# Altium schematic sheet Si5395_CLK_GEN.SchDoc
size 594 x 420 mm
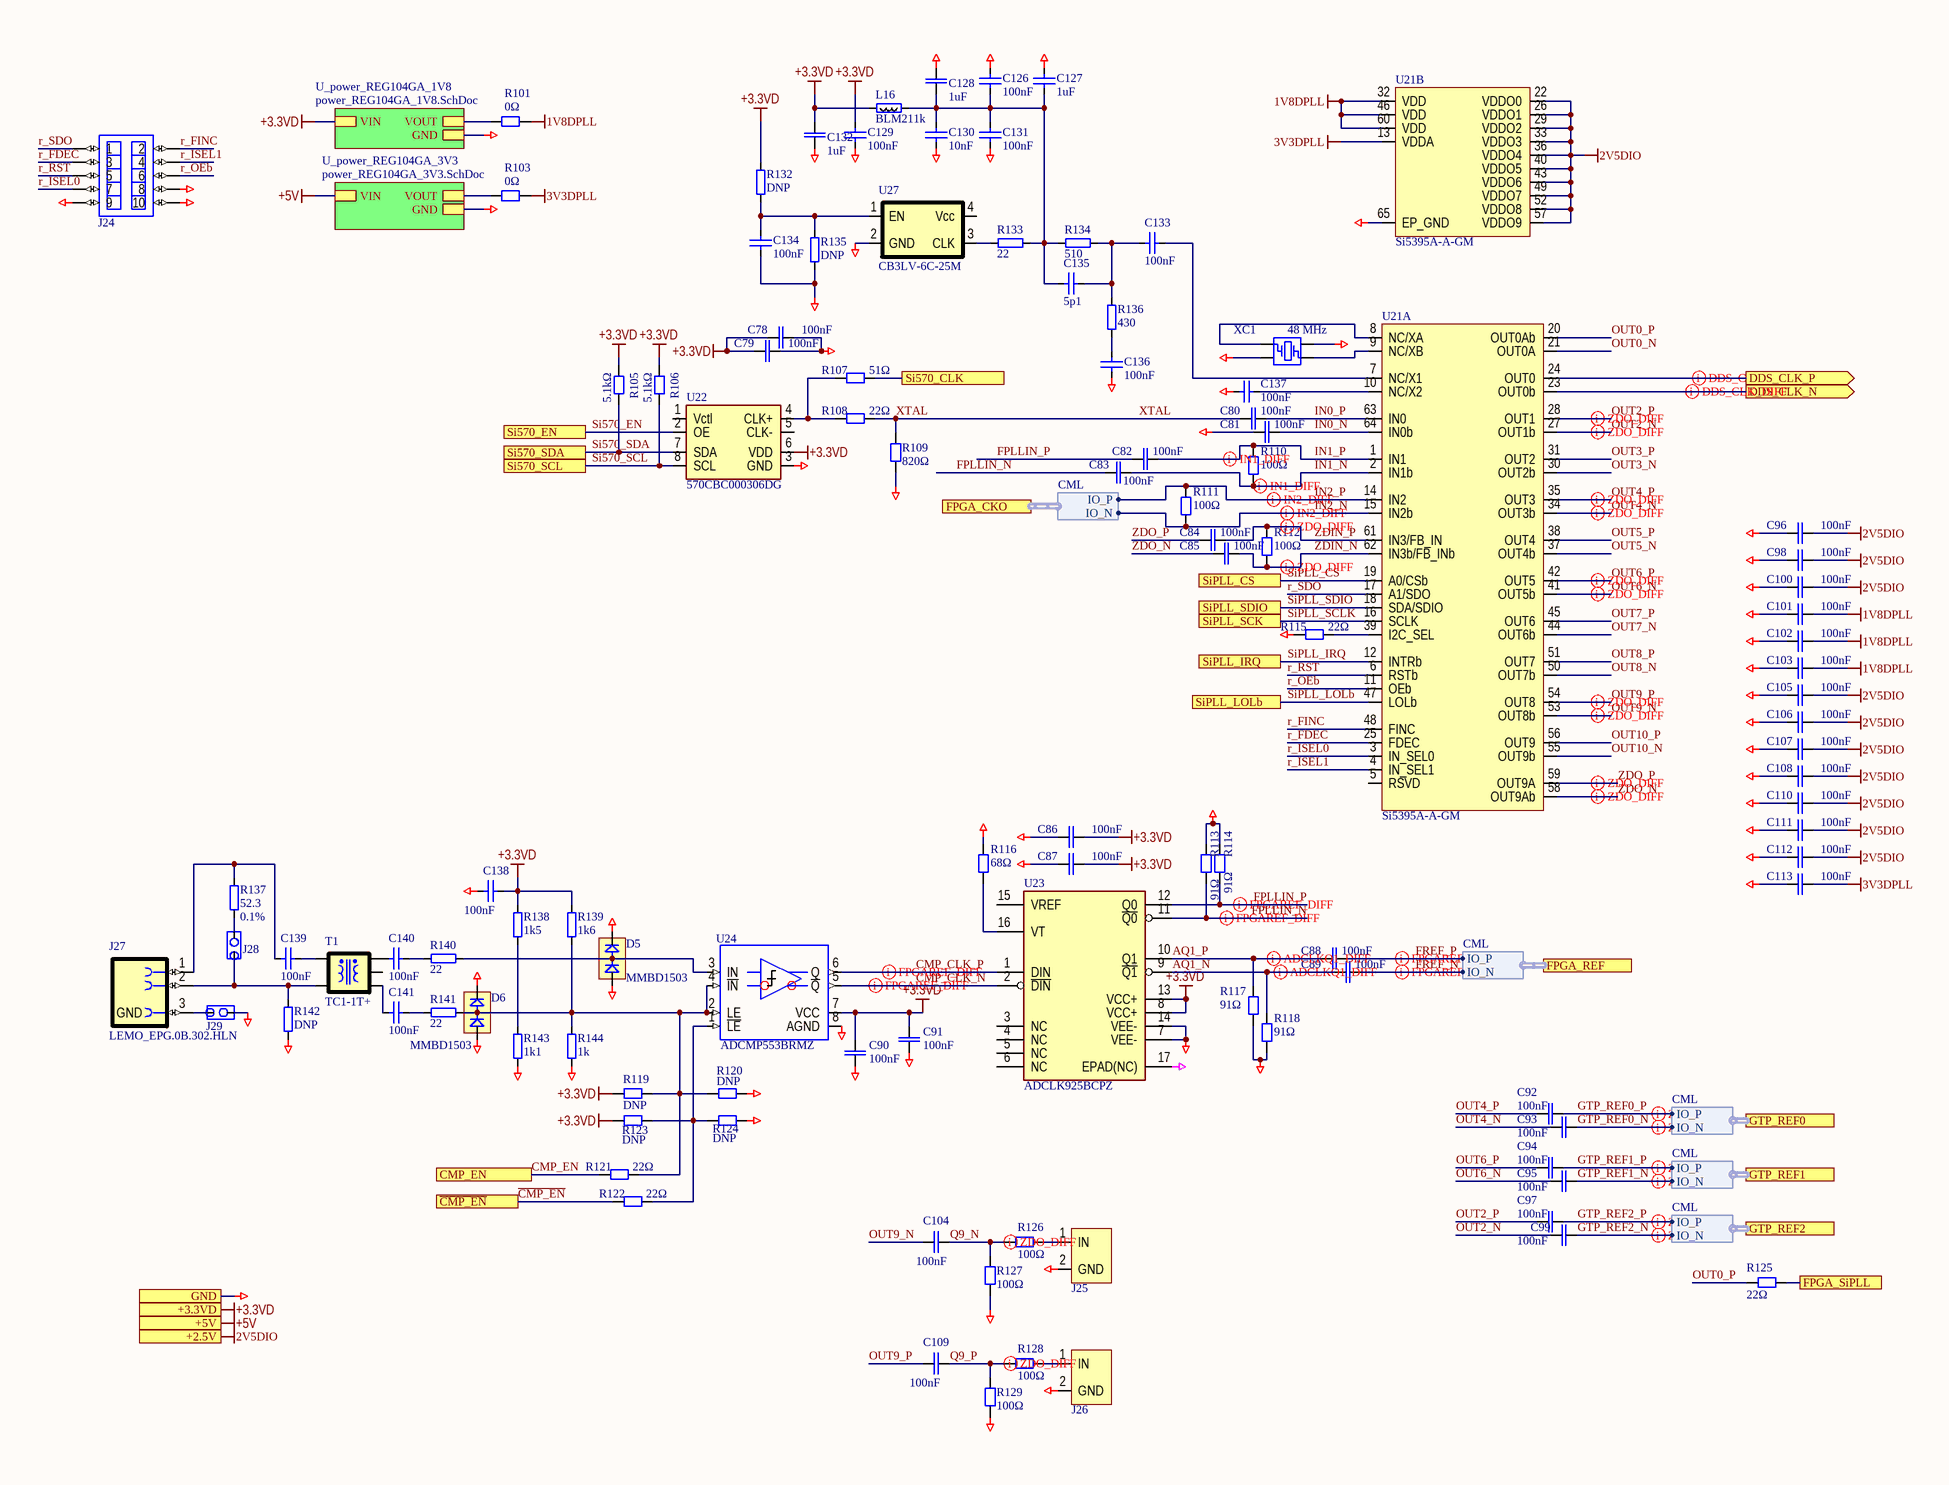
[diagram p0: Si5395_CLK_GEN.SchDoc]

## Parts
C78  100nF  [CAPC1608N]
C79  100nF  [CAPC1608N]
C80  100nF  [CAPC1608N]
C81  100nF  [CAPC1608N]
C82  100nF  [CAPC1608N]
C83  100nF  [CAPC1608N]
C84  100nF  [CAPC1608N]
C85  100nF  [CAPC1608N]
C86  100nF  [CAPC1608N]
C87  100nF  [CAPC1608N]
C88  100nF  [CAPC1608N]
C89  100nF  [CAPC1608N]
C90  100nF  [CAPC1608N]
C91  100nF  [CAPC1608N]
C92  100nF  [CAPC1608N]
C93  100nF  [CAPC1608N]
C94  100nF  [CAPC1608N]
C95  100nF  [CAPC1608N]
C96  100nF  [CAPC1608N]
C97  100nF  [CAPC1608N]
C98  100nF  [CAPC1608N]
C99  100nF  [CAPC1608N]
C100  100nF  [CAPC1608N]
C101  100nF  [CAPC1608N]
C102  100nF  [CAPC1608N]
C103  100nF  [CAPC1608N]
C104  100nF  [CAPC1608N]
C105  100nF  [CAPC1608N]
C106  100nF  [CAPC1608N]
C107  100nF  [CAPC1608N]
C108  100nF  [CAPC1608N]
C109  100nF  [CAPC1608N]
C110  100nF  [CAPC1608N]
C111  100nF  [CAPC1608N]
C112  100nF  [CAPC1608N]
C113  100nF  [CAPC1608N]
C126  100nF  [SMD0805CAP]
C127  1uF  [SMD0805CAP]
C128  1uF  [0508]
C129  100nF  [CAPC1608X87N]
C130  10nF  [CAPC1608X87N]
C131  100nF  [CAPC1608X87N]
C132  1uF  [0508]
C133  100nF  [CAPC1608X87N]
C134  100nF  [CAPC1608X87N]
C135  5p1  [CAPC1608X87N]
C136  100nF  [CAPC1608X87N]
C137  100nF  [CAPC1608X87N]
C138  100nF  [SMD0805CAP]
C139  100nF  [SMD0805CAP]
C140  100nF  [SMD0805CAP]
C141  100nF  [SMD0805CAP]
D5  MMBD1503  [SOT95P280X115-3N]
D6  MMBD1503  [SOT95P280X115-3N]
J24  DNP  [PLD-10]  (value not drawn)
J25  DNP  [LEMO_EPA.00.250.NTN]  (value not drawn)
J26  DNP  [LEMO_EPA.00.250.NTN]  (value not drawn)
J27  LEMO_EPG.0B.302.HLN  [LEMO_EPG.0B.302.HLN]
J28  PLS-2  [PLS-2]  (value not drawn)
J29  PLS-2  [PLS-2]  (value not drawn)
L16  BLM211k  [RESC2012X50N]
R101  0Ω  [RESC2012N]
R103  0Ω  [RESC2012N]
R105  5.1kΩ  [RESC2012N]
R106  5.1kΩ  [RESC2012N]
R107  51Ω  [RESC2012N]
R108  22Ω  [RESC1608N]
R109  820Ω  [RESC1608N]
R110  100Ω  [RESC1608N]
R111  100Ω  [RESC1608N]
R112  100Ω  [RESC1608N]
R113  91Ω  [RESC1608N]
R114  91Ω  [RESC1608N]
R115  22Ω  [RESC1608N]
R116  68Ω  [RESC1608N]
R117  91Ω  [RESC1608N]
R118  91Ω  [RESC1608N]
R119  DNP  [RESC1608N]
R120  DNP  [RESC1608N]
R121  22Ω  [RESC1608N]
R122  22Ω  [RESC1608N]
R123  DNP  [RESC1608N]
R124  DNP  [RESC1608N]
R125  22Ω  [RESC1608N]
R126  100Ω  [RESC1608N]
R127  100Ω  [RESC1608N]
R128  100Ω  [RESC1608N]
R129  100Ω  [RESC1608N]
R132  DNP  [SMD0805RES]
R133  22  [SMD0805RES]
R134  510  [SMD0805RES]
R135  DNP  [SMD0805RES]
R136  430  [SMD0805RES]
R137  52.3  Tolerance: 0.1%  [SMD0805RES]
R138  1k5  [SMD0805RES]
R139  1k6  [SMD0805RES]
R140  22  [SMD0805RES]
R141  22  [SMD0805RES]
R142  DNP  [SMD0805RES]
R143  1k1  [SMD0805RES]
R144  1k  [SMD0805RES]
T1  TC1-1T+  [XFMR_MINI-CIRCUITS_AT224]
U21  Si5395A-A-GM  [QFN50P900X900X100-65N-S530]  (parts A,B of 2)
U22  570CBC000306DG  [FP-57x-MFG]
U23  ADCLK925BCPZ  [QFN50P300X300X100-17N-S150]
U24  ADCMP553BRMZ  [SOP65P490X110-8N]
U27  CB3LV-6C-25M  [OSCSC508P500X700X160-4N]
XC1  value 48 MHz  [SMD3225_4PIN_XTAL]  (hidden comment: CX3225SB48000D0WPSC1)

## Sub-sheets
U_power_REG104GA_1V8 = power_REG104GA_1V8.SchDoc: GND, VOUT, VIN
U_power_REG104GA_3V3 = power_REG104GA_3V3.SchDoc: GND, VOUT, VIN

## Ports
+2.5V, +3.3VD, +5V, CMP_EN, DDS_CLK_N (out), DDS_CLK_P (out), FPGA_CKO (harness CML), FPGA_REF (harness CML), FPGA_SiPLL, GND, GTP_REF0 (harness CML), GTP_REF1 (harness CML), GTP_REF2 (harness CML), Si570_CLK, Si570_EN, Si570_SCL, Si570_SDA, SiPLL_CS, SiPLL_IRQ, SiPLL_LOLb, SiPLL_SCK, SiPLL_SDIO, ~{CMP_EN}

## Harnesses
CML: IO_N, IO_P

## Nets
1V8DPLL: C101.2 C102.2 C103.2 R101.1 U21.32(VDD) U21.46(VDD) U21.60(VDD)
2V5DIO: C96.2 C98.2 C100.2 C105.2 C106.2 C107.2 C108.2 C110.2 C111.2 C112.2 U21.22(VDDO0) U21.26(VDDO1) U21.29(VDDO2) U21.33(VDDO3) U21.36(VDDO4) U21.40(VDDO5) U21.43(VDDO6) U21.49(VDDO7) U21.52(VDDO8) U21.57(VDDO9) ; port +2.5V
3V3DPLL: C113.2 R103.1 U21.13(VDDA)
+3.3VD: C78.1 C79.1 C86.2 C87.2 C90.1 C91.1 C129.2 C132.1 C138.1 L16.1 R105.1 R106.1 R119.1 R123.1 R132.2 R138.2 R139.2 U22.6(VDD) U23.8(VCC+) U23.13(VCC+) U24.7(VCC) ; port +3.3VD, sheet U_power_REG104GA_1V8/VIN
+5V: port +5V, sheet U_power_REG104GA_3V3/VIN
GEPAD: U23.17(EPAD(NC))
GND: C78.2 C79.2 C81.1 C86.1 C87.1 C90.2 C91.2 C96.1 C98.1 C100.1 C101.1 C102.1 C103.1 C105.1 C106.1 C107.1 C108.1 C110.1 C111.1 C112.1 C113.1 C126.1 C127.1 C128.2 C129.1 C130.1 C131.1 C132.2 C134.1 C136.1 C137.2 C138.2 D5.1 D5.2 D6.1 D6.2 J24.8 J24.9 J24.10 J25.2(GND) J26.2(GND) J29.2 R109.2 R113.2 R114.2 R115.1 R116.2 R117.1 R118.1 R120.2 R124.2 R127.1 R129.1 R135.1 R142.1 R143.1 R144.1 U21.65(EP_GND) U22.3(GND) U23.7(VEE-) U23.14(VEE-) U24.8(AGND) U27.2(GND) XC1.2(SLD) XC1.4(SLD) ; port GND, sheet U_power_REG104GA_1V8/GND, sheet U_power_REG104GA_3V3/GND
AQ1_N: C89.1 R118.2 U23.9(~{Q1})
AQ1_P: C88.1 R117.2 U23.10(Q1)
~{CMP_EN}: R122.1 ; port ~{CMP_EN}
CMP_CLK_N: U23.2(~{DIN}) U24.5(~{Q})
CMP_CLK_P: U23.1(DIN) U24.6(Q)
CMP_EN: R121.1 ; port CMP_EN
DDS_CLK_N: U21.23(OUT0b) ; port DDS_CLK_N
DDS_CLK_P: U21.24(OUT0) ; port DDS_CLK_P
FPGA_SiPLL: R125.2 ; port FPGA_SiPLL
FPLLIN_N: C83.1 R113.1 U23.11(~{Q0})
FPLLIN_P: C82.1 R114.1 U23.12(Q0)
FREF_N: C89.2 ; port FPGA_REF.IO_N
FREF_P: C88.2 ; port FPGA_REF.IO_P
GTP_REF0_N: C93.2 ; port GTP_REF0.IO_N
GTP_REF0_P: C92.2 ; port GTP_REF0.IO_P
GTP_REF1_N: C95.2 ; port GTP_REF1.IO_N
GTP_REF1_P: C94.2 ; port GTP_REF1.IO_P
GTP_REF2_N: C99.2 ; port GTP_REF2.IO_N
GTP_REF2_P: C97.2 ; port GTP_REF2.IO_P
IN0_N: C81.2 U21.64(IN0b)
IN0_P: C80.2 U21.63(IN0)
IN1_N: C83.2 R110.1 U21.2(IN1b)
IN1_P: C82.2 R110.2 U21.1(IN1)
IN2_N: R111.1 U21.15(IN2b) ; port FPGA_CKO.IO_N
IN2_P: R111.2 U21.14(IN2) ; port FPGA_CKO.IO_P
OUT0_N: U21.21(OUT0A)
OUT0_P: R125.1 U21.20(OUT0Ab)
OUT2_N: C99.1 U21.27(OUT1b)
OUT2_P: C97.1 U21.28(OUT1)
OUT3_N: U21.30(OUT2b)
OUT3_P: U21.31(OUT2)
OUT4_N: C93.1 U21.34(OUT3b)
OUT4_P: C92.1 U21.35(OUT3)
OUT5_N: U21.37(OUT4b)
OUT5_P: U21.38(OUT4)
OUT6_N: C95.1 U21.41(OUT5b)
OUT6_P: C94.1 U21.42(OUT5)
OUT7_N: U21.44(OUT6b)
OUT7_P: U21.45(OUT6)
OUT8_N: U21.50(OUT7b)
OUT8_P: U21.51(OUT7)
OUT9_N: C104.1 U21.53(OUT8b)
OUT9_P: C109.1 U21.54(OUT8)
OUT10_N: U21.55(OUT9b)
OUT10_P: U21.56(OUT9)
Q9_N: C104.2 R126.1 R127.2
Q9_P: C109.2 R128.1 R129.2
r_FDEC: J24.3 U21.25(FDEC)
r_FINC: J24.2 U21.48(FINC)
r_ISEL0: J24.7 U21.3(IN_SEL0)
r_ISEL1: J24.4 U21.4(IN_SEL1)
r_OEb: J24.6 U21.11(OEb)
r_RST: J24.5 U21.6(RSTb)
r_SDO: J24.1 U21.17(A1/SDO)
Si570_CLK: R107.2 ; port Si570_CLK
Si570_EN: U22.2(OE) ; port Si570_EN
Si570_SCL: R106.2 U22.8(SCL) ; port Si570_SCL
Si570_SDA: R105.2 U22.7(SDA) ; port Si570_SDA
SiPLL_CS: U21.19(A0/CSb) ; port SiPLL_CS
SiPLL_IRQ: U21.12(INTRb) ; port SiPLL_IRQ
SiPLL_LOLb: U21.47(LOLb) ; port SiPLL_LOLb
SiPLL_SCLK: U21.16(SCLK) ; port SiPLL_SCK
SiPLL_SDIO: U21.18(SDA/SDIO) ; port SiPLL_SDIO
XTAL: C80.1 R108.2 R109.1
ZDIN_N: C85.2 R112.1 U21.62(IN3b/FB_INb)
ZDIN_P: C84.2 R112.2 U21.61(IN3/FB_IN)
ZDO_N: C85.1 U21.58(OUT9Ab)
ZDO_P: C84.1 U21.59(OUT9A)
NetC126_2: C126.2 C127.2 C128.1 C130.2 C131.2 C135.2 L16.2 R133.1 R134.2
NetC133_1: C133.1 U21.7(NC/X1)
NetC133_2: C133.2 C135.1 R134.1 R136.1
NetC134_2: C134.2 R132.1 R135.2 U27.1(EN)
NetC136_2: C136.2 R136.2
NetC137_1: C137.1 U21.10(NC/X2)
NetC139_1: C139.1 J27.1 R137.2
NetC139_2: C139.2 T1.4
NetC140_1: C140.1 T1.3
NetC140_2: C140.2 R140.2
NetC141_1: C141.1 T1.1
NetC141_2: C141.2 R141.2
NetD5_3: D5.3 R140.1 U24.3(IN)
NetD6_3: D6.3 R119.2 R120.1 R121.2 R139.1 R141.1 R144.2 U24.2(LE) U24.4(~{IN})
NetJ25_1: J25.1(IN) R126.2
NetJ26_1: J26.1(IN) R128.2
NetJ27_2: J27.2 J28.1 R142.2 T1.6
NetJ27_3: J27.3(GND) J29.1
NetJ28_2: J28.2 R137.1
NetR101_2: R101.2 ; sheet U_power_REG104GA_1V8/VOUT
NetR103_2: R103.2 ; sheet U_power_REG104GA_3V3/VOUT
NetR107_1: R107.1 R108.1 U22.4(CLK+)
NetR115_2: R115.2 U21.39(I2C_SEL)
NetR116_1: R116.1 U23.16(VT)
NetR122_2: R122.2 R123.2 R124.1 U24.1(~{LE})
NetR133_2: R133.2 U27.3(CLK)
NetR138_1: R138.1 R143.2
NetU21_8: U21.8(NC/XA) XC1.1(XTAL+)
NetU21_9: U21.9(NC/XB) XC1.3(XTAL-)

Not connected (* = marked no-connect by the designer): T1 2; U21 5(RSVD); U22 1(Vctl) 5(CLK-); U23 3(NC) 4(NC) 5(NC) 6(NC) 15(VREF); U27 4(Vcc)

## Layout directives
differential pair; rule Differential Pairs Routing [Pref Gap = 0.175mm    Min Gap  = 0.075mm    Max Gap  = 0.5mmPref Width = 0.15mm    Min Width  = 0.075mm    Max Width  = 0.5mm]: IN1_N, IN1_P, IN2_N, IN2_P, OUT2_N, OUT2_P, OUT4_N, OUT4_P, OUT6_N, OUT6_P, OUT9_N, OUT9_P, Q9_N, Q9_P, ZDIN_N, ZDIN_P, ZDO_N, ZDO_P
differential pair; rule Differential Pairs Routing [Pref Gap = 0.175mm    Min Gap  = 0.075mm    Max Gap  = 0.5mmPref Width = 0.25mm    Min Width  = 0.075mm    Max Width  = 0.5mm]: AQ1_N, AQ1_P, CMP_CLK_N, CMP_CLK_P, DDS_CLK_N, DDS_CLK_P, FPLLIN_N, FPLLIN_P, FREF_N, FREF_P
differential pair; rule Differential Pairs Routing [Pref Gap = 0.4mm    Min Gap  = 0.075mm    Max Gap  = 0.5mmPref Width = 0.3mm    Min Width  = 0.075mm    Max Width  = 0.5mm]: GTP_REF0_N, GTP_REF0_P, GTP_REF1_N, GTP_REF1_P, GTP_REF2_N, GTP_REF2_P

## Notes on the sheet
- Подп. и дата
- Инв. № дубл.
- Взам. инв. №
- Инв. № подл.
- Изм.
- Лист
- № докум.
- Подп.
- Дата
- Копировал
- Формат А2

## Library data of the parts
C78-C113 = CAPC: Generic ceramic SMD capacitor; Pkg: 0603; Maintainer: Evgeniy Kotov; SMD Solders: 2; THD Solders: 0; PartField: 100nF; Last Change Data: 06.03.2017; Release Date: 06.03.2017; Value: 100nF
C126 C127 = C0805: Чип конденсатор 0805; Voltage: 25V; Vendor: Vishay; DielectricType: X5R; SMD Solders: 2; Solder Option: RM; Tolerance: 20%; Pkg: SMD0805; Device: Cap0805; Price: 2
  C126: Value: 100nF
  C127: Value: 1uF
C128 C132 = CAP_LLL219R71A105: 1uF; 10V; 0805R; X7R; Low ESL; Reverse geometry; Vendor: muRata; SolderOption: 2; THD Solders: 0; PartField: LLL219R71A105; Pkg: 0508; Value: 1uF; SMD Solders: 2; ClassName: Soldered_BINP
C129-C131 C133-C137 = C0603: Чип конденсатор 0603; Voltage: 50V; Vendor: Vishay; DielectricType: X5R; SMD Solders: 2; Solder Option: RM; Tolerance: 20%; Pkg: SMD0603; Device: Cap603; Price: 2
  C129 C131 C133 C134 C136 C137: Value: 100nF
  C130: Value: 10nF
  C135: Value: 5p1
C138-C141 = C0805: Чип конденсатор 0805; Voltage: 50V; Vendor: Vishay; DielectricType: X5R; SMD Solders: 2; Solder Option: RM; Tolerance: 20%; Pkg: SMD0805; Device: Cap0805; Value: 100nF; Price: 2
D5 D6 = MMBD1503: High Conductance Low Leakage Diode; SolderOption: 0; Pkg: SOT-3N; SMD Solders: 3; HelpURL: https://www.engineering.uiowa.edu/sites/default/files/ees/files/NI/pdfs/01/30/DS013013.pdf; Value: MMBD1503; PartField: MMBD1503; THD Solders: 0
J24 = IDC-10MS: Connector, 5x2, Male, 2.54mm Pitch, Strait contacts, with Body; PartField: IDC-10MC; SMD Solders: 0; THD Solders: 10; Maintainer: Evgeniy Kotov; Pkg: IDC-10; Last Change Data: 28.03.2017; Release Date: 28.03.2017; Value: DNP; ComponentLink1Description: Datasheet
J25 J26 = LEMO_EPA.00.250: PartField: EPA.00.250.NTN; SolderOption: 0; Pkg: LEMO 5pin; THD Solders: 5; Value: DNP; SMD Solders: 0
J27 = LEMO_EPG.0B.302.HLN: LEMO дифференциальный, угдовой; SMD Solders: 0; Solder Option: RM; THD Solders: 6; Price: 5000; Vendor: LEMO; Pkg: LEMO_EPG.0B.302.HLN; Device: LEMO_EPG.0B.302.HLN; Name to order: LEMO_EPG.0B.302.HLN
J28 J29 = PLS-2: Connector, 5x2, Male, 2.54mm Pitch, Right Angle; SMD Solders: 0; THD Solders: 2; Maintainer: Evgeniy Kotov; PartField: PLS-2; Last Change Data: 02.04.2017; Release Date: 02.04.2017; Value: PLS-2; ComponentLink1Description: Datasheet; Pkg: PLS-2
L16 = BLM21: SMD Ferrite bead 0805; Vendor: Vishay; Value: 1k; Pkg: SMD0805; SMD Solders: 2; Solder Option: RM; Price: 10; Device: BLM21
R101 R103 R105-R107 = RESC: Resistor, Generic, SMD; Pkg: 0805; Maintainer: Evgeniy Kotov; SMD Solders: 2; THD Solders: 0; Release Date: 06.03.2017; Last Change Data: 09.03.2017
  R101 R103: PartField: 0Ω; Value: 0Ω
  R105 R106: PartField: 5.1kΩ; Value: 5.1kΩ
  R107: PartField: 51Ω; Value: 51Ω
R108-R118 R121 R122 R125-R129 = RESC: Resistor, Generic, SMD; Pkg: 0603; Maintainer: Evgeniy Kotov; SMD Solders: 2; THD Solders: 0; Release Date: 06.03.2017; Last Change Data: 09.03.2017
  R108 R115 R121 R122 R125: PartField: 22Ω; Value: 22Ω
  R109: PartField: 820Ω; Value: 820Ω
  R110-R112 R126-R129: PartField: 100Ω; Value: 100Ω
  R113 R114 R117 R118: PartField: 91Ω; Value: 91Ω
  R116: PartField: 68Ω; Value: 68Ω
R119 R120 R123 R124 = RESC: Resistor, Generic, SMD; PartField: *Ω; Pkg: 0603; Maintainer: Evgeniy Kotov; SMD Solders: 2; THD Solders: 0; Release Date: 06.03.2017; Last Change Data: 09.03.2017; Value: DNP
R132 R135 R138 R139 R142-R144 = R0805: Чип резистор 0805; Vendor: Vishay; SMD Solders: 2; Solder Option: i; TC: 100ppm/C; Tolerance: 1%; Pkg: SMD0805; Pwr: 125mW; Device: Res0805; Price: 2
  R132 R135 R142: Value: DNP
  R138: Value: 1k5
  R139: Value: 1k6
  R143: Value: 1k1
  R144: Value: 1k
R133 R134 R136 R140 R141 = R0805: Чип резистор 0805; Vendor: Vishay; SMD Solders: 2; Solder Option: RM; TC: 100ppm/C; Tolerance: 1%; Pkg: SMD0805; Pwr: 125mW; Device: Res0805; Price: 2
  R133 R140 R141: Value: 22
  R134: Value: 510
  R136: Value: 430
R137 = R0805: Чип резистор 0805; Vendor: Vishay; SMD Solders: 2; Solder Option: RM; TC: 100ppm/C; Pkg: SMD0805; Pwr: 125mW; Device: Res0805; Price: 2; Value: 52.3
T1 = TC1-1T+: RF Transformer; 50Ω; 1.5 to 500 MHz; Impedance Ratio=1; Vendor: Texas Instruments; Value: 1:1; Pkg: AT1521; SMD Solders: 5; Solder Option: RM; THD Solders: 0; Price: 1000; Device: TC1-1T+; Name to order: TC1-1T+
U21 = Si5395A: Manufacturer: SiLabs; SMD Solders: 65; THD Solders: 0; Pkg: QFN-64EP; PartField: Si5395A-A-GM; Value: Si5395A; Vendor: SiLabs
U22 = Si570: XTAL OSCILLATOR SMD; Manufacturer: Silicon Labs; Manufacturer Part Number: 541AAA001040BAGR; Min Supply Voltage: 2.375V; Max Supply Voltage: 3.465V; Pkg: SMD 6pin; Frequency: 0.2-1500MHz; Nominal Supply Current: 100mA; Maintainer: Evgeniy Kotov; SMD Solders: 6; THD Solders: 0; Value: Si570; Device Class L2: Clock and Timing; ComponentLink2Description: Datasheet; RoHS: TRUE; Device Class L1: Integrated Circuits (ICs); Height: 1.33mm; Octopart: https://octopart.com/541aaa001040bagr-silicon+labs-103392146; ComponentLink2URL: https://www.silabs.com/documents/public/data-sheets/si541-datasheet.pdf; Temperature Range High: +85°C; Category: IC; Ambient Temperature Range High: +85°C; Digikey Description: XTAL OSCILLATOR SMD; Lead Free: Yes; Ambient Temperature Range Low: -40°C; Device Class L3: Timers and Oscillators; Automotive: No; Temperature: -40°C to +85°C; Temperature Range Low: -40°C; Last Change Data: 09.03.2017; PartField: 570CBC000306DG
U23 = ADCLK925BCPZ: IC CLK FANOUT BUFFER 1:2 16LFCSP; Manufacturer: Silicon Labs; Number Of Inputs: 2; Standoff Height: 0mm; Number Of Outputs: 4; Pkg: LFCSP-16EP; Max Junction Temp: +125°C; Min Supply Voltage: 1.71V; Number Of Elements: 1; Nominal Supply Current: 65mA; Max Supply Voltage: 3.63V; Logic Function: Non-Inverting; Propagation Delay: 875ps; Maintainer: Evgeniy Kotov; SMD Solders: 17; THD Solders: 0; Manufacturer Part Number: ADCLK925BCPZ; Ambient Temperature Range High: +85°C; Device Class L2: Clock and Timing; Temperature: -40°C to +85°C; Automotive: No; Height: 0.9mm; ComponentLink2URL: https://www.silabs.com/documents/public/data-sheets/si5330x-datasheet.pdf; ComponentLink2Description: Datasheet; Temperature Range High: +85°C; Category: IC; Ambient Temperature Range Low: -40°C; Device Class L1: Integrated Circuits (ICs); Octopart: https://octopart.com/si53307-b-gm-silicon+labs-51374320; Mouser Description: Clock Buffer 1:2 Univ bufr/Lvl Trans 725MHz; Temperature Range Low: -40°C; Device Class L3: Clock Buffers; Ipc Land Pattern Name: QFN50P300X300X85-16; RoHS: TRUE; Digikey Description: IC CLK BUFFER 2:4 725MHZ 16QFN; Lead Free: Yes; PartField: ADCLK925BCPZ; Last Change Data: 09.03.2017; Value: ADCLK925BCPZ
U24 = ADCMP553BRMZ: LVDS Comparator; Vendor: Analog Devices Inc; SolderOption: 0; Pkg: MSOP-8; SMD Solders: 8; Manufacturer_Part_Number: ADCMP553BRMZ; Value: ADCMP553BRMZ; PartField: ADCMP553BRMZ; THD Solders: 0
U27 = CB3LV: Clock generator; Vendor: CTS Electronic Components; Pkg: 7x5mm; SMD Solders: 4; Solder Option: RM; THD Solders: 0; Current: 60; Value: -6C-25M; Price: 1000; Device: CB3LV; Name to order: CB3LV-6C-25M
XC1 = XTAL_CX3225SB48: Kyocera XTAL 48MHz CX3225SB48000D0WPSC1; Pkg: 4 pin SMD; Maintainer: Evgeniy Kotov; SMD Solders: 4; THD Solders: 0; PartField: CX3225SB48000D0WPSC1; Vendor: Kyocera; Release Date: 06.03.2017; Last Change Data: 09.03.2017